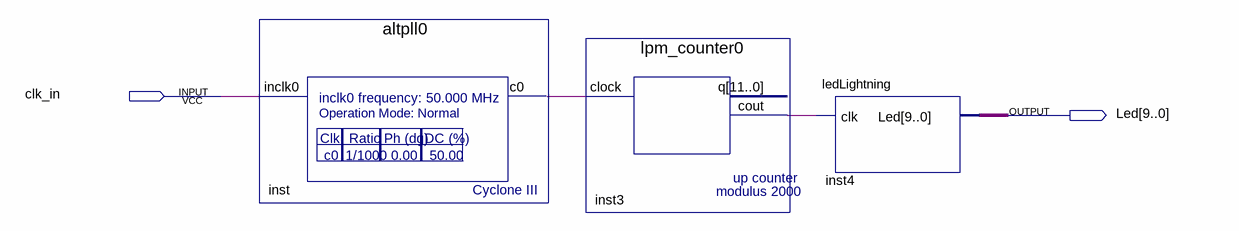
[diagram p0: schematic sheet]
// Quartus schematic Lab2.bdf as structural Verilog: 3 symbols, 2 pins
module Lab2 (
  input  clk_in,
  output [9:0] Led
);

  wire inst3_cout, inst_c0;

  altpll0 inst (.inclk0(clk_in), .c0(inst_c0));
  lpm_counter0 inst3 (.clock(inst_c0), .cout(inst3_cout));  // open: q
  ledLightning inst4 (.clk(inst3_cout), .Led(Led));
endmodule
